# Altium schematic sheet REVISION HI.SchDoc
size 431 x 279 mm; SheetNumber: 4; SheetTotal: 4
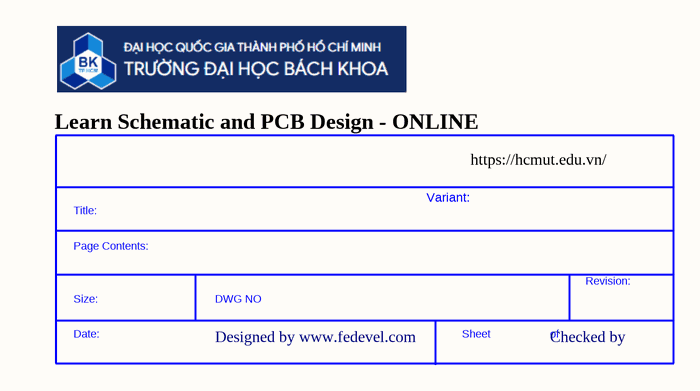
[diagram p0: REVISION HI.SchDoc]

## Parts
*?  SDTitleBlock  (value not drawn)  (graphical)

## Notes on the sheet
- (near *?) Learn Schematic and PCB Design - ONLINE
- Variant:
- https://hcmut.edu.vn/
- Designed by www.fedevel.com
- Checked by
- (in symbol SDTitleBlock) Title:; Page Contents:; Revision:; Size:; DWG NO; Date:; Sheet; of